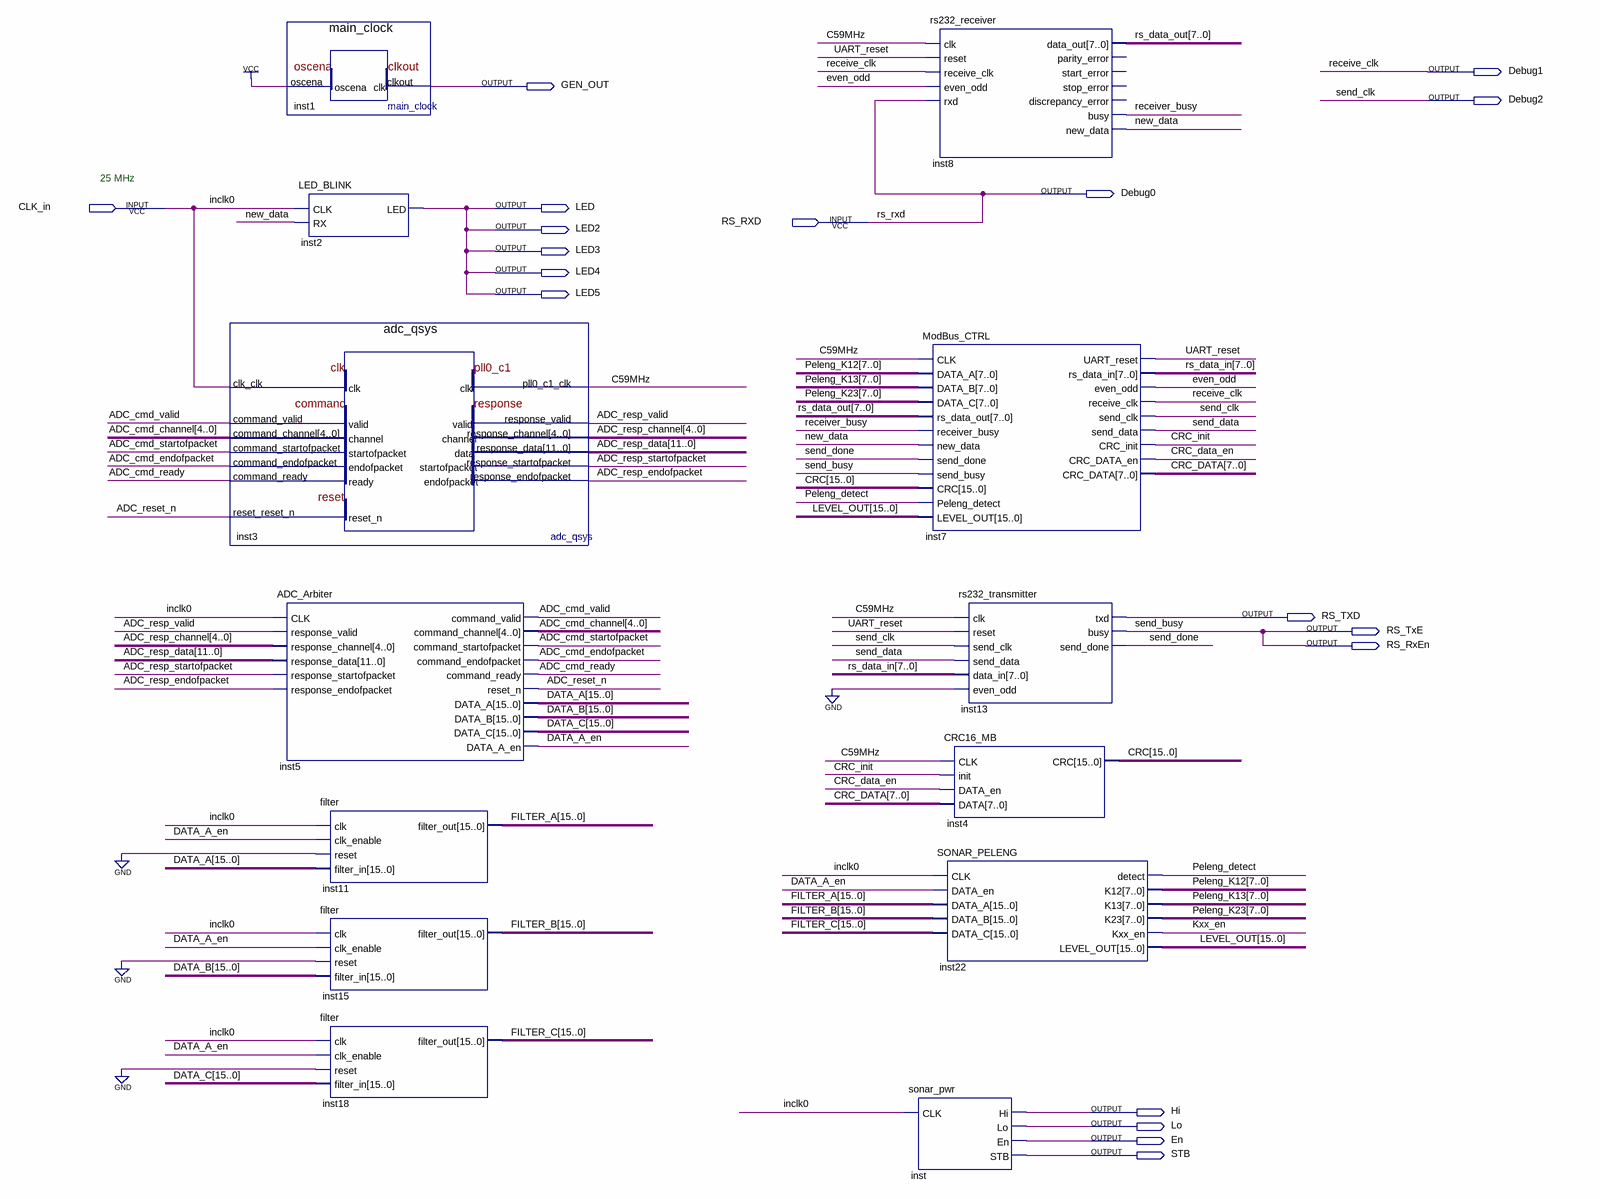
[diagram p0: schematic sheet]
// Quartus schematic SONAR1.bdf as structural Verilog: 13 symbols, 18 pins
module SONAR1 (
  input  CLK_in,
  input  RS_RXD,
  output Debug1,
  output GEN_OUT,
  output Debug2,
  output Debug0,
  output LED,
  output LED2,
  output LED3,
  output LED4,
  output LED5,
  output RS_TXD,
  output RS_TxE,
  output RS_RxEn,
  output Hi,
  output Lo,
  output En,
  output STB
);

  wire ADC_cmd_endofpacket, ADC_cmd_ready, ADC_cmd_startofpacket, ADC_cmd_valid, ADC_reset_n,
       ADC_resp_endofpacket, ADC_resp_startofpacket, ADC_resp_valid, C59MHz, CRC_data_en, CRC_init,
       DATA_A_en, even_odd, Kxx_en, new_data, Peleng_detect, receiver_busy, send_data, send_done, UART_reset;
  wire [4:0] ADC_cmd_channel, ADC_resp_channel;
  wire [7:0] CRC_DATA, Peleng_K12, Peleng_K13, Peleng_K23, rs_data_in, rs_data_out;
  wire [11:0] ADC_resp_data;
  wire [15:0] CRC, DATA_A, DATA_B, DATA_C, FILTER_A, FILTER_B, FILTER_C, LEVEL_OUT;

  adc_qsys inst3 (
    .clk_clk(CLK_in), .command_valid(ADC_cmd_valid), .command_channel(ADC_cmd_channel),
    .command_startofpacket(ADC_cmd_startofpacket), .command_endofpacket(ADC_cmd_endofpacket),
    .reset_reset_n(ADC_reset_n), .command_ready(ADC_cmd_ready), .pll0_c1_clk(C59MHz),
    .response_valid(ADC_resp_valid), .response_channel(ADC_resp_channel), .response_data(ADC_resp_data),
    .response_startofpacket(ADC_resp_startofpacket), .response_endofpacket(ADC_resp_endofpacket));
  main_clock inst1 (.oscena(1'b1), .clkout(GEN_OUT));
  ADC_Arbiter inst5 (
    .CLK(CLK_in), .response_valid(ADC_resp_valid), .response_channel(ADC_resp_channel),
    .response_data(ADC_resp_data), .response_startofpacket(ADC_resp_startofpacket),
    .response_endofpacket(ADC_resp_endofpacket), .command_valid(ADC_cmd_valid),
    .command_channel(ADC_cmd_channel), .command_startofpacket(ADC_cmd_startofpacket),
    .command_endofpacket(ADC_cmd_endofpacket), .command_ready(ADC_cmd_ready), .reset_n(ADC_reset_n),
    .DATA_A(DATA_A), .DATA_B(DATA_B), .DATA_C(DATA_C), .DATA_A_en(DATA_A_en));
  LED_BLINK inst2 (.CLK(CLK_in), .RX(new_data), .LED(LED));
  filter inst11 (.clk(CLK_in), .clk_enable(DATA_A_en), .reset(1'b0), .filter_in(DATA_A), .filter_out(FILTER_A));
  filter inst15 (.clk(CLK_in), .clk_enable(DATA_A_en), .reset(1'b0), .filter_in(DATA_B), .filter_out(FILTER_B));
  filter inst18 (.clk(CLK_in), .clk_enable(DATA_A_en), .reset(1'b0), .filter_in(DATA_C), .filter_out(FILTER_C));
  ModBus_CTRL inst7 (
    .CLK(C59MHz), .DATA_A(Peleng_K12), .DATA_B(Peleng_K13), .DATA_C(Peleng_K23), .rs_data_out(rs_data_out),
    .receiver_busy(receiver_busy), .new_data(new_data), .send_done(send_done), .send_busy(RS_RxEn),
    .CRC(CRC), .Peleng_detect(Peleng_detect), .LEVEL_OUT(LEVEL_OUT), .UART_reset(UART_reset),
    .rs_data_in(rs_data_in), .even_odd(even_odd), .receive_clk(Debug1), .send_clk(Debug2),
    .send_data(send_data), .CRC_init(CRC_init), .CRC_DATA_en(CRC_data_en), .CRC_DATA(CRC_DATA));
  sonar_pwr inst (.CLK(CLK_in), .Hi(Hi), .Lo(Lo), .En(En), .STB(STB));
  rs232_receiver inst8 (
    .clk(C59MHz), .reset(UART_reset), .receive_clk(Debug1), .even_odd(even_odd), .rxd(RS_RXD),
    .data_out(rs_data_out), .busy(receiver_busy), .new_data(new_data));  // open: parity_error, start_error, stop_error, discrepancy_error
  rs232_transmitter inst13 (
    .clk(C59MHz), .reset(UART_reset), .send_clk(Debug2), .send_data(send_data), .data_in(rs_data_in),
    .even_odd(1'b0), .txd(RS_TXD), .busy(RS_RxEn), .send_done(send_done));
  CRC16_MB inst4 (.CLK(C59MHz), .init(CRC_init), .DATA_en(CRC_data_en), .DATA(CRC_DATA), .CRC(CRC));
  SONAR_PELENG inst22 (
    .CLK(CLK_in), .DATA_en(DATA_A_en), .DATA_A(FILTER_A), .DATA_B(FILTER_B), .DATA_C(FILTER_C),
    .K12(Peleng_K12), .K13(Peleng_K13), .K23(Peleng_K23), .Kxx_en(Kxx_en), .LEVEL_OUT(LEVEL_OUT),
    .detect(Peleng_detect));

  assign Debug0 = RS_RXD;
  assign LED2 = LED;
  assign LED3 = LED;
  assign LED4 = LED;
  assign LED5 = LED;
  assign RS_TxE = RS_RxEn;

  // Other names for the same wires on the sheet: inclk0 = CLK_in; receive_clk = Debug1; send_busy = RS_RxEn;
  //   send_clk = Debug2

  // Notes on the sheet:
  //   25 MHz
endmodule
